# EAGLE design V1 (EAGLE 8.5.1)

## Sheet 1 of 6
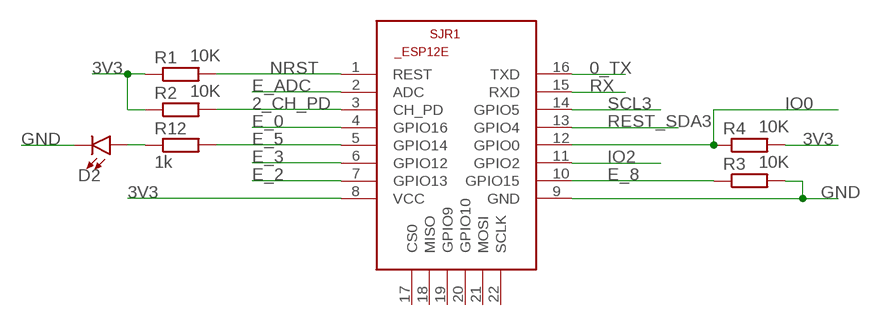
[diagram p0: schematic, sheet 1]

### Parts
D2  LED5MM  [LED_5MM]
R1  10K  R-EU_0207/10  [0207/10]
R2  10K  R-EU_0207/10  [0207/10]
R3  10K  R-EU_0207/10  [0207/10]
R4  10K  R-EU_0207/10  [0207/10]
R12  1k  R-EU_0207/10  [0207/10]
SJR1  ESP8266-12EESP12E  [ESP8266-ESP12E]

### Nets
0_TX: SJR1.16(TXD) ; also sheet 3
2_CH_PD: R2.2 SJR1.3(CH_PD) ; also sheet 3
3V3: R1.1 R2.1 R4.2 SJR1.8(VCC) ; also sheet 2
E_0: SJR1.4(GPIO16)
E_2: SJR1.7(GPIO13)
E_3: SJR1.6(GPIO12)
E_5: R12.2 SJR1.5(GPIO14)
E_8: R3.1 SJR1.10(GPIO15)
E_ADC: SJR1.2(ADC)
GND: D2.K(C) R3.2 SJR1.9(GND) ; also sheet 2,3,4,5,6
IO0: R4.1 SJR1.12(GPIO0)
IO2: SJR1.11(GPIO2)
N$12: D2.A R12.1
NRST: R1.2 SJR1.1(REST)
REST_SDA3: SJR1.13(GPIO4) ; also sheet 5
RX: SJR1.15(RXD) ; also sheet 5
SCL3: SJR1.14(GPIO5)
Unconnected: SJR1.17(CS0) SJR1.18(MISO) SJR1.19(GPIO9) SJR1.20(GPIO10) SJR1.21(MOSI) SJR1.22(SCLK)

## Sheet 2 of 6
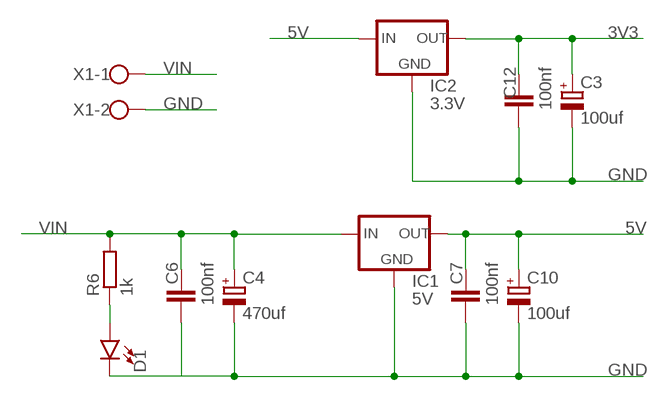
[diagram p1: schematic, sheet 2]

### Parts
C3  100uf  CPOL-EUE3.5-8  [E3,5-8]
C4  470uf  CPOL-EUE3.5-8  [E3,5-8]
C6  100nf  C-EU050-030X075  [C050-030X075]
C7  100nf  C-EU050-030X075  [C050-030X075]
C10  100uf  CPOL-EUE3.5-8  [E3,5-8]
C12  100nf  C-EU050-030X075  [C050-030X075]
D1  LED5MM  [LED_5MM]
IC1  5V  V_REG_78XXSIDE  [78XXL]
IC2  3.3V  V_REG_78XXSIDE  [78XXL]
R6  1k  R-EU_0207/10  [0207/10]
X1  W237-102  [W237-102]

### Nets
3V3: C3.+ C12.2 IC2.OUT ; also sheet 1
5V: C7.2 C10.+ IC1.OUT IC2.IN ; also sheet 3,4,6
GND: C3.- C4.- C6.1 C7.1 C10.- C12.1 D1.K(C) IC1.GND IC2.GND X1.2 ; also sheet 1,3,4,5,6
N$5: D1.A R6.1
VIN: C4.+ C6.2 IC1.IN R6.2 X1.1

## Sheet 3 of 6
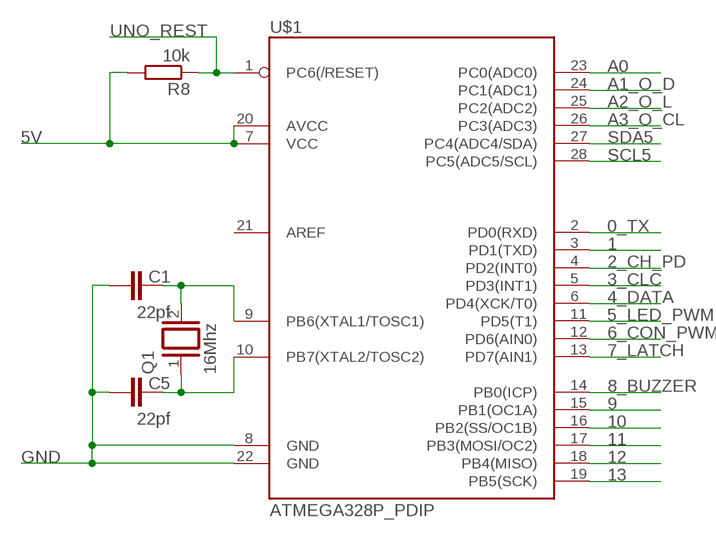
[diagram p2: schematic, sheet 3]

### Parts
C1  22pf  C-EU050-030X075  [C050-030X075]
C5  22pf  C-EU050-030X075  [C050-030X075]
Q1  16Mhz  XTAL/S  [QS]
R8  10k  R-EU_0207/10  [0207/10]
U$1  ATMEGA328P_PDIP  [DIL-28-3]

### Nets
0_TX: U$1.2(PD0(RXD)) ; also sheet 1
1: U$1.3(PD1(TXD)) ; also sheet 5
2_CH_PD: U$1.4(PD2(INT0)) ; also sheet 1
3_CLC: U$1.5(PD3(INT1)) ; also sheet 4
4_DATA: U$1.6(PD4(XCK/T0)) ; also sheet 4
5_LED_PWM: U$1.11(PD5(T1)) ; also sheet 5
5V: R8.2 U$1.7(VCC) U$1.20(AVCC) ; also sheet 2,4,6
6_CON_PWM: U$1.12(PD6(AIN0)) ; also sheet 5
7_LATCH: U$1.13(PD7(AIN1)) ; also sheet 4
8_BUZZER: U$1.14(PB0(ICP)) ; also sheet 5
9: U$1.15(PB1(OC1A)) ; also sheet 4
10: U$1.16(PB2(SS/OC1B)) ; also sheet 4
11: U$1.17(PB3(MOSI/OC2)) ; also sheet 4
12: U$1.18(PB4(MISO))
13: U$1.19(PB5(SCK))
A0: U$1.23(PC0(ADC0))
A1_O_D: U$1.24(PC1(ADC1)) ; also sheet 6
A2_O_L: U$1.25(PC2(ADC2)) ; also sheet 6
A3_O_CL: U$1.26(PC3(ADC3)) ; also sheet 6
GND: C1.1 C5.1 U$1.8(GND) U$1.22(GND) ; also sheet 1,2,4,5,6
N$4: C5.2 Q1.1 U$1.10(PB7(XTAL2/TOSC2))
N$16: C1.2 Q1.2 U$1.9(PB6(XTAL1/TOSC1))
SCL5: U$1.28(PC5(ADC5/SCL))
SDA5: U$1.27(PC4(ADC4/SDA))
UNO_REST: R8.1 U$1.1(PC6(/RESET)) ; also sheet 5
Unconnected: U$1.21(AREF)

## Sheet 4 of 6
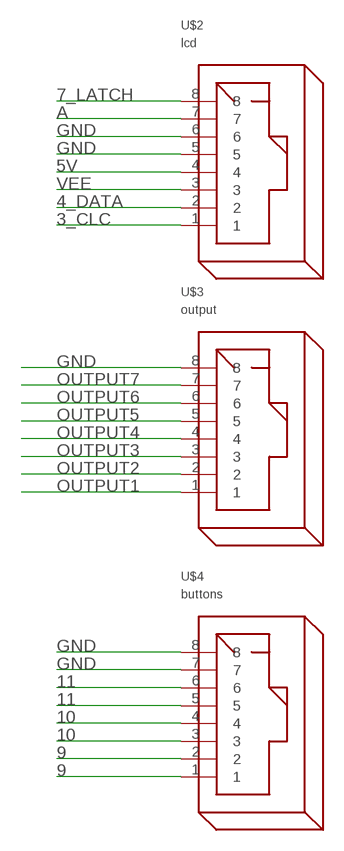
[diagram p3: schematic, sheet 4]

### Parts
U$2  lcd  RJ45  [RJ45]
U$3  output  RJ45  [RJ45]
U$4  buttons  RJ45  [RJ45]

### Nets
3_CLC: U$2.1 ; also sheet 3
4_DATA: U$2.2 ; also sheet 3
5V: U$2.4 ; also sheet 2,3,6
7_LATCH: U$2.8 ; also sheet 3
9: U$4.1 U$4.2 ; also sheet 3
10: U$4.3 U$4.4 ; also sheet 3
11: U$4.5 U$4.6 ; also sheet 3
A: U$2.7 ; also sheet 5
GND: U$2.5 U$2.6 U$3.8 U$4.7 U$4.8 ; also sheet 1,2,3,5,6
OUTPUT1: U$3.1 ; also sheet 6
OUTPUT2: U$3.2 ; also sheet 6
OUTPUT3: U$3.3 ; also sheet 6
OUTPUT4: U$3.4 ; also sheet 6
OUTPUT5: U$3.5 ; also sheet 6
OUTPUT6: U$3.6 ; also sheet 6
OUTPUT7: U$3.7 ; also sheet 6
VEE: U$2.3 ; also sheet 5

## Sheet 5 of 6
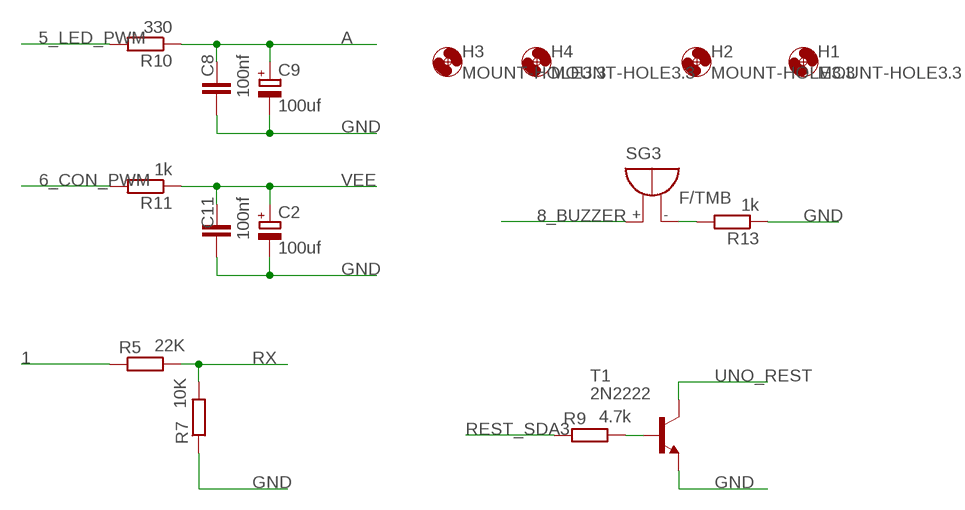
[diagram p4: schematic, sheet 5]

### Parts
C2  100uf  CPOL-EUE3.5-8  [E3,5-8]
C8  100nf  C-EU050-030X075  [C050-030X075]
C9  100uf  CPOL-EUE3.5-8  [E3,5-8]
C11  100nf  C-EU050-030X075  [C050-030X075]
H1  MOUNT-HOLE3.3  [3,3]
H2  MOUNT-HOLE3.3  [3,3]
H3  MOUNT-HOLE3.3  [3,3]
H4  MOUNT-HOLE3.3  [3,3]
R5  22K  R-EU_0207/10  [0207/10]
R7  10K  R-EU_0207/10  [0207/10]
R9  4.7k  R-EU_0207/10  [0207/10]
R10  330  R-EU_0207/10  [0207/10]
R11  1k  R-EU_0207/10  [0207/10]
R13  1k  R-EU_0207/10  [0207/10]
SG3  F/TMB  [F/TMB]
T1  2N2222  [TO92-EBC-OVAL]

### Nets
1: R5.1 ; also sheet 3
5_LED_PWM: R10.2 ; also sheet 3
6_CON_PWM: R11.2 ; also sheet 3
8_BUZZER: SG3.+ ; also sheet 3
A: C8.2 C9.+ R10.1 ; also sheet 4
GND: C2.- C8.1 C9.- C11.1 R7.1 R13.1 T1.E ; also sheet 1,2,3,4,6
N$11: R9.2 T1.B
N$15: R13.2 SG3.-
REST_SDA3: R9.1 ; also sheet 1
RX: R5.2 R7.2 ; also sheet 1
UNO_REST: T1.C ; also sheet 3
VEE: C2.+ C11.2 R11.1 ; also sheet 4

## Sheet 6 of 6
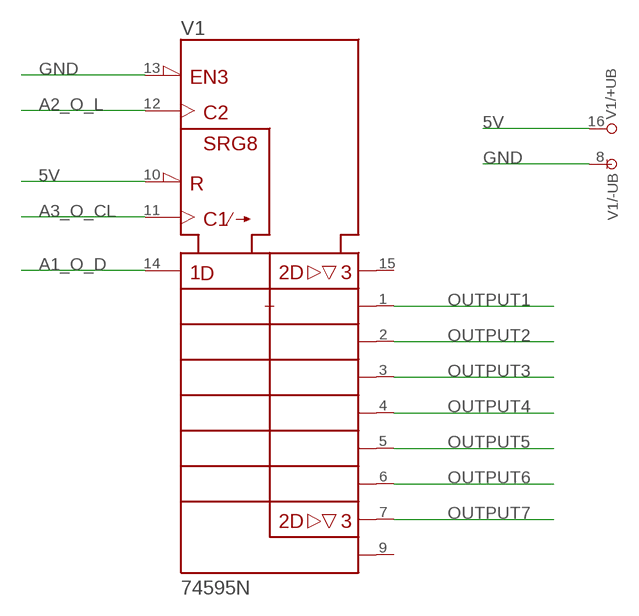
[diagram p5: schematic, sheet 6]

### Parts
V1  74595N  [DIL16]

### Nets
5V: V1.10(!SRCLR) V1.16(+UB) ; also sheet 2,3,4
A1_O_D: V1.14(SER) ; also sheet 3
A2_O_L: V1.12(RCK) ; also sheet 3
A3_O_CL: V1.11(SRCK) ; also sheet 3
GND: V1.8(-UB) V1.13(!G) ; also sheet 1,2,3,4,5
OUTPUT1: V1.1(QB) ; also sheet 4
OUTPUT2: V1.2(QC) ; also sheet 4
OUTPUT3: V1.3(QD) ; also sheet 4
OUTPUT4: V1.4(QE) ; also sheet 4
OUTPUT5: V1.5(QF) ; also sheet 4
OUTPUT6: V1.6(QG) ; also sheet 4
OUTPUT7: V1.7(QH) ; also sheet 4
Unconnected: V1.9(QH*) V1.15(QA)

## Library data of the parts
C1 C5-C8 C11 C12 = rcl:C-EU: CAPACITOR, European symbol
C2-C4 C9 C10 = rcl:CPOL-EU: POLARIZED CAPACITOR, European symbol
D1 D2 = SparkFun-LED:LED: LED (Generic) Standard schematic elements and footprints for 5mm, 3mm, 1206, and 0603 sized LEDs. Generic LEDs with no color specified.
H1-H4 = holes:MOUNT-HOLE: MOUNTING HOLE with drill center marker
IC1 IC2 = SparkFun:V_REG_78XX: Voltage Regulator Standard 7805 5V regulator. IGO (Input Ground Output). Spark Fun Electronics SKU : COM-00107
Q1 = special:XTAL/S: CRYSTAL
R1-R5 R7 R9 = rcl:R-EU_: RESISTOR, European symbol; SPICEPREFIX: R
R6 R8 R10-R13 = rcl:R-EU_: RESISTOR, European symbol
SG3 = buzzer:F/TMB: BUZZER Source: Buerklin; OC_FARNELL: unknown; OC_NEWARK: unknown
SJR1 = esp12e:ESP8266-12E: ESP8266-12E Library for Eagle CAD The author not responsible for any damages or errors!. Created by Suhail jr.lt;/author>
T1 = adafruit:2N2222: NPN TRANSISTOR Big oval pads
U$1 = FaBo-MPU:ATMEGA328P_PDIP
U$2-U$4 = con-rj:RJ45: RJ45 RJ45 jacks side mounted http://www.tycoelectronics.com
V1 = 74ttl-din:74*595: 8-bit SHIFT REGISTER, output latch
X1 = con-wago-500:W237-102: WAGO SCREW CLAMP; MPN: 237-102; OC_FARNELL: unknown; OC_NEWARK: 70K9898

## Board
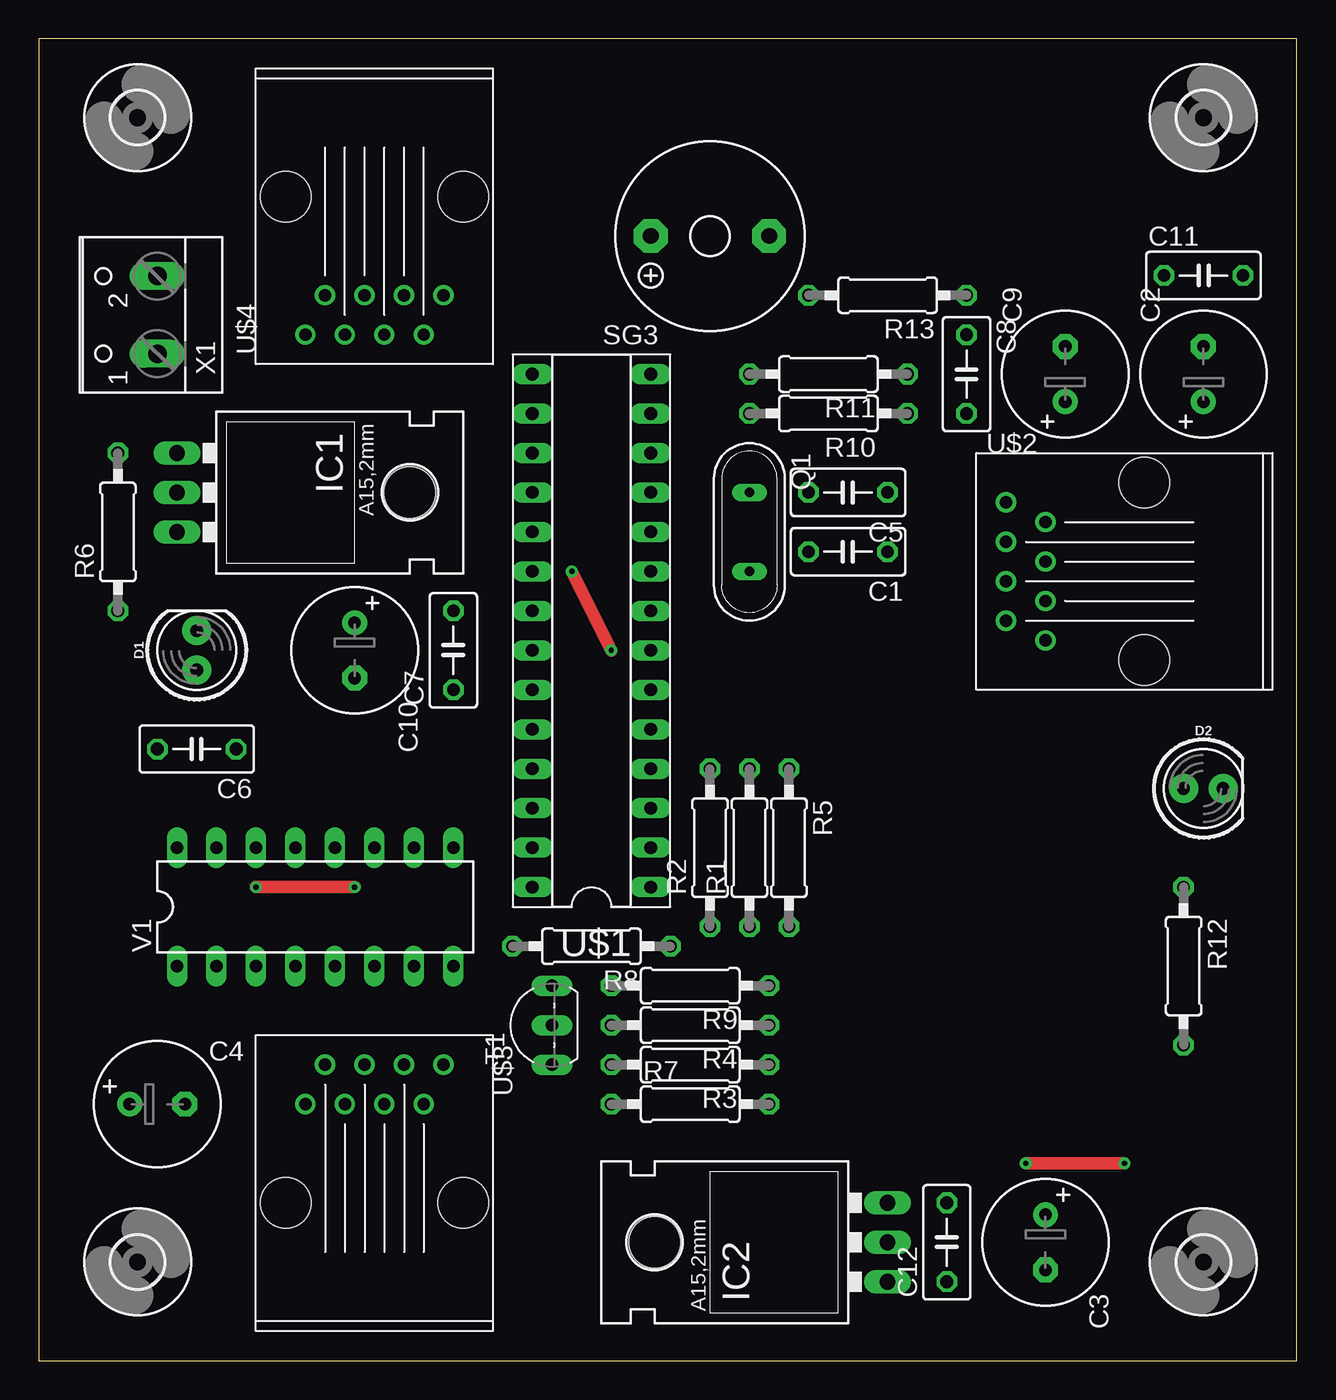
[diagram p6: board, top side]
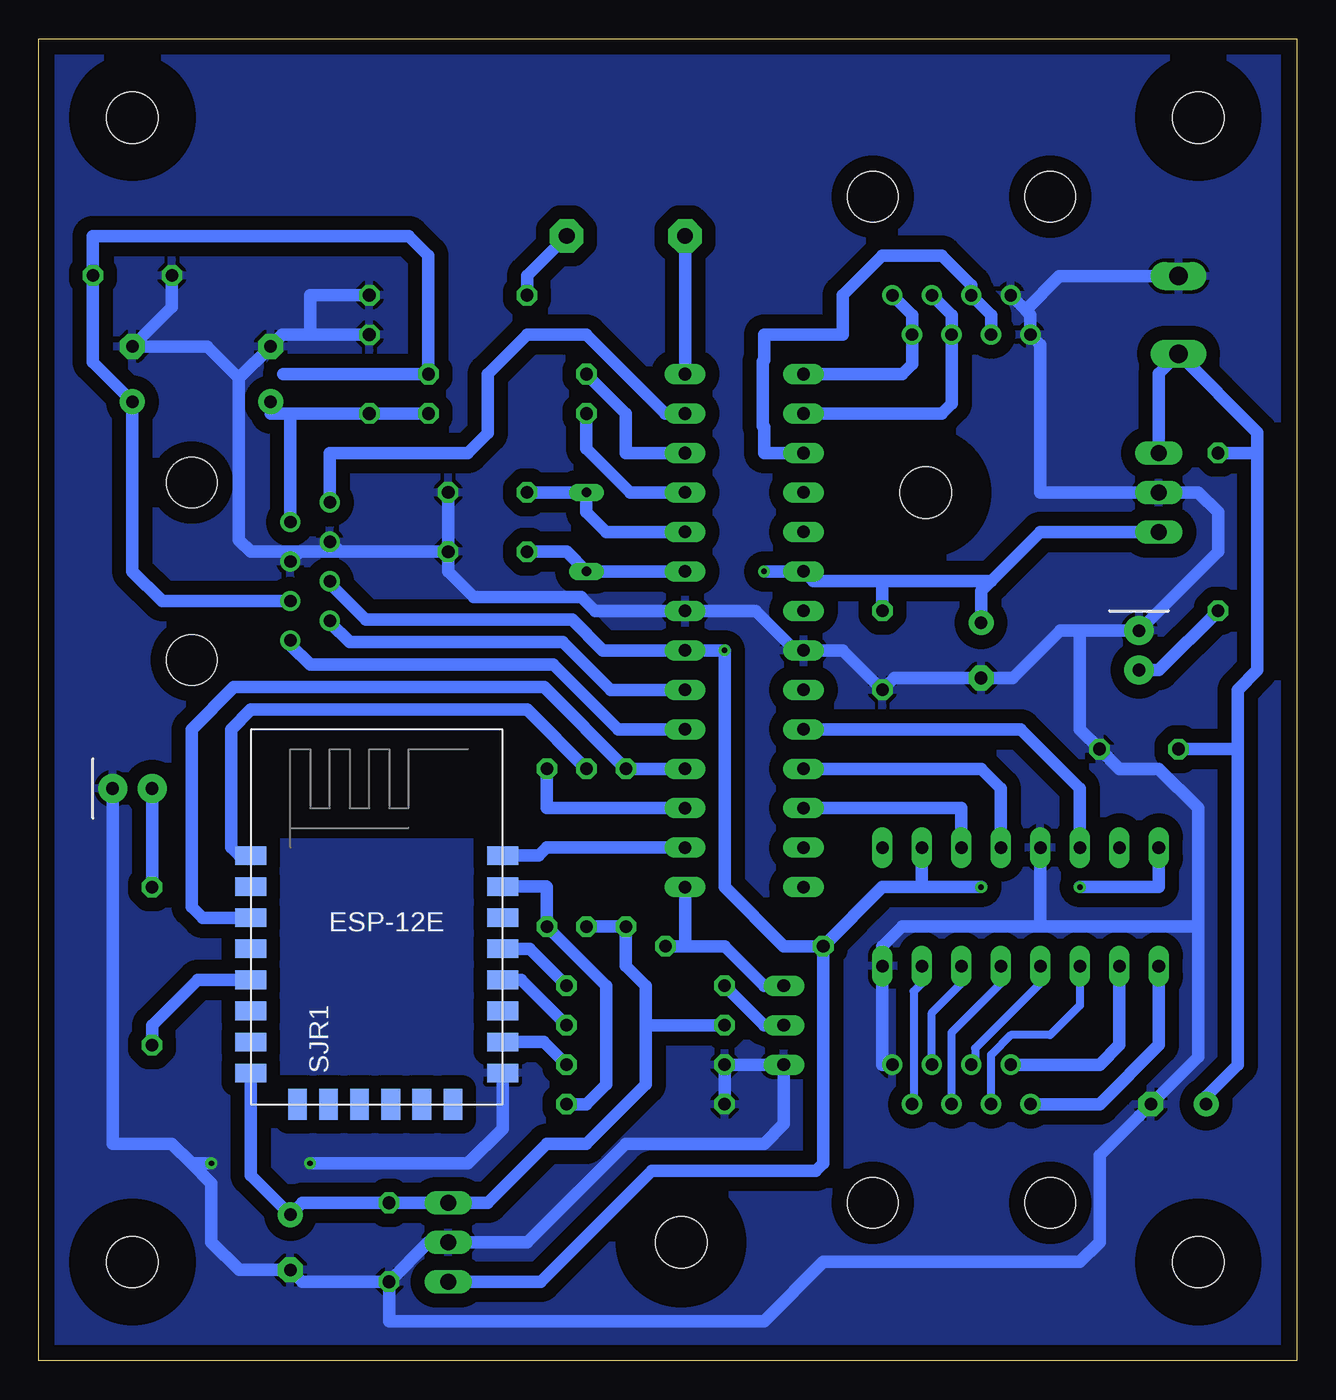
[diagram p7: board, bottom side, seen from below]

Size 80.95 x 85.08 mm. Coordinates in mm from the lower left corner, seen from the top.
Outline: 0,0 80.95,0 80.95,85.08 0,85.08 0,0
Copper layers (1*16): Top 0.035mm / dielectric 1.5mm / Bottom 0.035mm
Design rules "default *": minimum track width 6mil, minimum drill 0.35mm, track to track 35mil, track to pad 35mil, pad to pad 6mil, via to via 6mil, smd to smd 6mil, copper to edge 40mil, drill to drill 6mil, minimum pad ring 10mil, minimum via ring 8mil, stop-mask expansion 4mil, vias tented up to drill 0mil, thermal gap 10mil

### Footprints (pad centres in the part's own frame; a part is rotated, then mirrored left to right if it is on the bottom)
C050-030X075 = drill 0.813 octagon: 1 -2.54,0; 2 2.54,0
E3,5-8 = drill 0.813 pad 1.6: + -1.778,0 | drill 0.813 pad 1.6 octagon: - 1.778,0
LED_5MM = drill 0.813 pad 1.88: A -1.27,0; K 1.27,0
3,3 = hole 3.3: 0,0
78XXL = drill 1.016 long: GND 0,-3.81; IN -2.54,-3.81; OUT 2.54,-3.81 | hole 3.302: 0,11.176
QS = drill 0.61 long: 1 -2.54,0; 2 2.54,0
0207/10 = drill 0.813 octagon: 1 -5.08,0; 2 5.08,0
F/TMB = drill 1.016 pad 2.159 octagon: + 3.81,0; - -3.81,0
ESP8266-ESP12E = smd 2 x 1.2: 1 -7.62,5.84; 2 -7.62,3.84; 3 -7.62,1.84; 4 -7.62,-0.16; 5 -7.62,-2.16; 6 -7.62,-4.16; 7 -7.62,-6.16; 8 -7.62,-8.16; 9 8.58,-8.16; 10 8.58,-6.16; 11 8.58,-4.16; 12 8.58,-2.16; 13 8.58,-0.16; 14 8.58,1.84; 15 8.58,3.84; 16 8.58,5.84 | smd 1.2 x 2: 17 -4.62,-10.16; 18 -2.62,-10.16; 19 -0.62,-10.16; 20 1.38,-10.16; 21 3.38,-10.16; 22 5.38,-10.16
TO92-EBC-OVAL = drill 0.813 long: B 0,-1.27; C 2.54,-1.27; E -2.54,-1.27
DIL-28-3 = drill 0.813 long: 1 -15.24,-3.81; 2 -12.7,-3.81; 3 -10.16,-3.81; 4 -7.62,-3.81; 5 -5.08,-3.81; 6 -2.54,-3.81; 7 0,-3.81; 8 2.54,-3.81; 9 5.08,-3.81; 10 7.62,-3.81; 11 10.16,-3.81; 12 12.7,-3.81; 13 15.24,-3.81; 14 17.78,-3.81; 15 17.78,3.81; 16 15.24,3.81; 17 12.7,3.81; 18 10.16,3.81; 19 7.62,3.81; 20 5.08,3.81; 21 2.54,3.81; 22 0,3.81; 23 -2.54,3.81; 24 -5.08,3.81; 25 -7.62,3.81; 26 -10.16,3.81; 27 -12.7,3.81; 28 -15.24,3.81
RJ45 = drill 0.8: 1 -6.35,-4.445; 2 -8.89,-3.175; 3 -6.35,-1.905; 4 -8.89,-0.635; 5 -6.35,0.635; 6 -8.89,1.905; 7 -6.35,3.175; 8 -8.89,4.445 | hole 3.25: 0,-5.715; 0,5.715
DIL16 = drill 0.813 long: 1 -8.89,-3.81; 2 -6.35,-3.81; 3 -3.81,-3.81; 4 -1.27,-3.81; 5 1.27,-3.81; 6 3.81,-3.81; 7 6.35,-3.81; 8 8.89,-3.81; 9 8.89,3.81; 10 6.35,3.81; 11 3.81,3.81; 12 1.27,3.81; 13 -1.27,3.81; 14 -3.81,3.81; 15 -6.35,3.81; 16 -8.89,3.81
W237-102 = drill 1.194 long: 1 -2.5,-1.27; 2 2.5,-1.27

### Placement (x,y rotation side)
C1  52.07,52.07 180 top
C2  74.93,63.5 90 top
C3  64.77,7.62 270 top
C4  7.62,16.51 0 top
C5  52.07,55.88 180 top
C6  10.16,39.37 180 top
C7  26.67,45.72 90 top
C8  59.69,63.5 270 top
C9  66.04,63.5 90 top
C10  20.32,45.72 270 top
C11  74.93,69.85 0 top
C12  58.42,7.62 90 top
D1  10.16,45.72 90 top
D2  74.93,36.83 0 top
H1  74.93,80.01 0 top
H2  6.35,80.01 0 top
H3  6.35,6.35 0 top
H4  74.93,6.35 0 top
IC1  12.7,55.88 270 top
IC2  50.8,7.62 90 top
Q1  45.72,53.34 270 top
R1  45.72,33.02 90 top
R2  43.18,33.02 90 top
R3  41.91,19.05 180 top
R4  41.91,21.59 180 top
R5  48.26,33.02 270 top
R6  5.08,53.34 90 top
R7  41.91,16.51 0 top
R8  35.56,26.67 180 top
R9  41.91,24.13 180 top
R10  50.8,60.96 180 top
R11  50.8,63.5 180 top
R12  73.66,25.4 270 top
R13  54.61,68.58 180 top
SG3  43.18,72.39 180 top
SJR1  59.69,26.67 0 bottom
T1  31.75,21.59 90 top
U$1  35.56,45.72 90 top
U$2  71.12,50.8 0 top
U$3  21.59,10.16 270 top
U$4  21.59,74.93 90 top
V1  17.78,29.21 0 top
X1  6.35,67.31 90 top

### Tracks (layer width: path | path; a pad name or v marks a point on that pad's centre or on a via)
0_TX
  Bottom 0.813: U$1.2 48.26,33.02 48.77,32.51 SJR1.16
1
  Bottom 0.813: U$1.3 48.26,35.56 R5.1
2_CH_PD
  Bottom 0.813: U$1.4 R2.2 48.44,43.36 68.4,43.36 71.12,40.64 71.12,29.21 70.42,28.51 SJR1.3
3_CLC
  Bottom 0.813: U$1.5 43.67,40.64 47.84,44.81 63.5,44.81 64.77,46.08 U$2.1
3V3
  Bottom 0.813: R4.2 41.91,21.59 | 41.91,21.59 41.91,24.13 43.18,25.4 R2.1 R1.1 | 41.91,21.59 41.91,17.78 45.72,13.97 48.26,13.97 52.07,10.16 IC2.OUT C12.2 64.01,10.16 C3.+ 67.31,11.94 SJR1.8
4_DATA
  Bottom 0.813: U$1.6 44.16,43.18 47.24,46.25 60.96,46.25 62.23,47.52 U$2.2
5_LED_PWM
  Bottom 0.813: R10.2 45.72,58.7 42.9,55.88 U$1.11
5V  (via drill 0.35)
  Top 0.813: v36.83,45.72 v34.29,50.8 | v13.97,30.48 v20.32,30.48
  Bottom 0.813: U$2.4 62.23,50.02 59.91,47.7 46.64,47.7 44.66,45.72 U$1.7 v36.83,45.72 36.83,30.48 33.02,26.67 R8.2 | v34.29,50.8 U$1.20 31.11,50.16 26.67,50.16 | IC1.OUT 16.51,53.34 19.68,50.16 | 19.68,50.16 20.32,49.53 C10.+ | 26.67,50.16 19.68,50.16 | C7.2 26.67,50.16 | V1.16 8.89,30.48 v13.97,30.48 | v20.32,30.48 24.13,30.48 | 24.13,30.48 V1.10 | R8.2 26.67,30.48 24.13,30.48 | R8.2 30.48,12.7 30.96,12.22 41.53,12.22 48.67,5.08 IC2.IN
6_CON_PWM
  Bottom 0.813: U$1.12 43.18,58.42 43.18,60.96 R11.2
7_LATCH
  Bottom 0.813: U$1.13 40.64,60.96 45.72,66.04 49.53,66.04 52.07,63.5 52.07,59.69 53.34,58.42 62.23,58.42 U$2.8
8_BUZZER
  Bottom 0.813: U$1.14 39.37,69.85 39.37,70.56 SG3.+
9
  Bottom 0.813: U$1.15 25.4,63.5 24.77,64.14 U$4.2 24.77,67.31 U$4.1
10
  Bottom 0.813: U$1.16 22.86,60.96 22.23,61.59 U$4.4 22.23,67.31 U$4.3
11
  Bottom 0.813: U$1.17 34.29,58.42 34.29,60.07 34.37,60.15 34.37,64.31 34.29,64.39 34.29,66.04 29.21,66.04 29.21,68.58 26.67,71.12 22.86,71.12 20.95,69.22 U$4.5 19.68,67.31 U$4.6
A
  Bottom 0.813: R10.1 C8.2 64.77,60.96 | 64.77,60.96 66.04,60.96 C9.+ | U$2.7 64.77,60.96
A1_O_D
  Bottom 0.813: V1.14 13.97,36.83 17.78,40.64 U$1.24
A2_O_L
  Bottom 0.813: V1.12 19.05,36.83 20.32,38.1 U$1.25
A3_O_CL
  Bottom 0.813: V1.11 21.59,35.56 U$1.26
E_5
  Bottom 0.813: R12.2 73.66,21.59 70.74,24.51 SJR1.5
E_8
  Bottom 0.813: R3.1 48.45,20.51 SJR1.10
GND  (via drill 0.35)
  Top 0.813: v63.5,12.7 v69.85,12.7
  Bottom 0.813: D2.K 76.2,13.97 72.39,13.97 71.12,12.7 | C1.1 C5.1 | C1.1 54.61,50.8 52.96,49.15 46.04,49.15 45.15,48.26 U$1.8 34.82,48.26 32.28,45.72 U$1.22 29.21,45.72 C7.1 25.91,43.94 C10.- 18.29,43.94 15.24,46.99 13.97,46.99 | C11.1 72.39,67.82 C2.- 70.11,65.28 68.07,63.24 | U$2.6 61.59,52.07 | 61.59,52.07 C1.1 | R13.1 63.5,68.58 63.5,66.04 | C8.1 63.5,66.04 | 63.5,66.04 65.28,66.04 C9.- 68.07,63.24 | U$2.5 64.14,52.07 | 64.14,52.07 61.59,52.07 | 64.14,52.07 67.31,52.07 68.07,52.83 68.07,63.24 | U$4.7 17.46,67.63 | 17.46,67.63 17.14,67.31 U$4.8 16.51,65.41 16.51,55.88 IC1.GND 6.35,55.88 5.08,54.61 5.08,52.07 D1.K 13.97,46.99 | 17.46,67.63 15.28,69.81 X1.2 | 16.51,31.75 V1.13 16.51,27.94 | U$3.8 26.67,19.05 V1.8 26.67,26.67 25.4,27.94 16.51,27.94 | 13.97,46.99 13.97,40.64 C6.1 11.43,38.1 8.89,38.1 6.35,35.56 6.35,27.94 | C4.- 6.35,19.56 6.35,27.94 | C4.- 10.16,15.75 | 16.51,27.94 6.35,27.94 | C4.- 12.7,13.21 12.7,7.62 13.97,6.35 30.48,6.35 34.29,2.54 58.42,2.54 C12.1 | R7.1 R3.2 T1.E 33.02,15.24 34.29,13.97 43.18,13.97 49.53,7.62 IC2.GND 55.88,7.62 C12.1 | C12.1 64.01,5.08 C3.- 68.07,5.84 69.85,7.62 69.85,11.43 71.12,12.7 | SJR1.9 51.11,14.93 53.34,12.7 v63.5,12.7 | v69.85,12.7 71.12,12.7
  pour Bottom: 2.54,85.09 81.28,85.09 82.55,83.82 82.55,2.54 80.01,0 0,0 0,83.82
IO0
  Bottom 0.813: R4.1 49.91,24.51 SJR1.12
N$4
  Bottom 0.813: C5.2 Q1.1 45.72,54.61 44.45,53.34 U$1.10
N$5
  Bottom 0.813: D1.A 8.89,44.45 R6.1
N$11
  Bottom 0.813: T1.B 34.29,21.59 R9.2
N$12
  Bottom 0.813: R12.1 D2.A
N$15
  Bottom 0.813: R13.2 49.53,69.85 SG3.-
N$16
  Bottom 0.813: U$1.9 Q1.2 46.99,52.07 C1.2
NRST
  Bottom 0.813: R1.2 49.53,41.91 67.31,41.91 68.58,40.64 68.58,33.02 68.07,32.51 SJR1.1
OUTPUT1
  Bottom 0.813: U$3.1 12.7,16.51 8.89,20.32 V1.1
OUTPUT2
  Bottom 0.813: U$3.2 12.7,19.05 11.43,20.32 V1.2
OUTPUT3
  Bottom 0.508: U$3.3 19.68,19.68 18.41,20.95 15.88,20.95 13.97,22.86 V1.3
OUTPUT4
  Bottom 0.508: V1.4 16.51,24.3 20.7,20.11 20.7,19.3 U$3.4
OUTPUT5
  Bottom 0.508: U$3.5 22.23,21.12 19.05,24.3 V1.5
OUTPUT6
  Bottom 0.508: U$3.6 23.5,22.39 21.59,24.3 V1.6
OUTPUT7
  Bottom 0.508: V1.7 24.13,24.3 24.66,23.77 24.66,16.62 U$3.7
REST_SDA3
  Bottom 0.813: R9.1 49.37,26.51 SJR1.13
RX
  Bottom 0.813: SJR1.15 48.29,30.51 48.26,30.48 R5.2 44.45,24.13 44.45,17.78 45.72,16.51 R7.2
UNO_REST
  Bottom 0.813: 39.37,26.67 36.83,26.67 34.29,24.13 T1.C | 39.37,26.67 R8.1 | 39.37,26.67 U$1.1
VEE
  Bottom 0.813: U$2.3 73.03,48.9 74.93,50.8 C2.+ 77.47,64.26 C11.2 77.47,72.39 57.15,72.39 55.88,71.12 R11.1 65.21,63.5
VIN
  Bottom 0.813: IC1.IN 8.89,63.54 X1.1 2.54,59.73 2.54,58.42 | 2.54,58.42 2.54,44.45 3.81,43.18 3.81,39.37 | C4.+ 5.84,17.02 3.81,19.05 3.81,39.37 | R6.2 2.54,58.42 | 3.81,39.37 C6.2